# Altium project Raspberry_Hub.PrjPcb
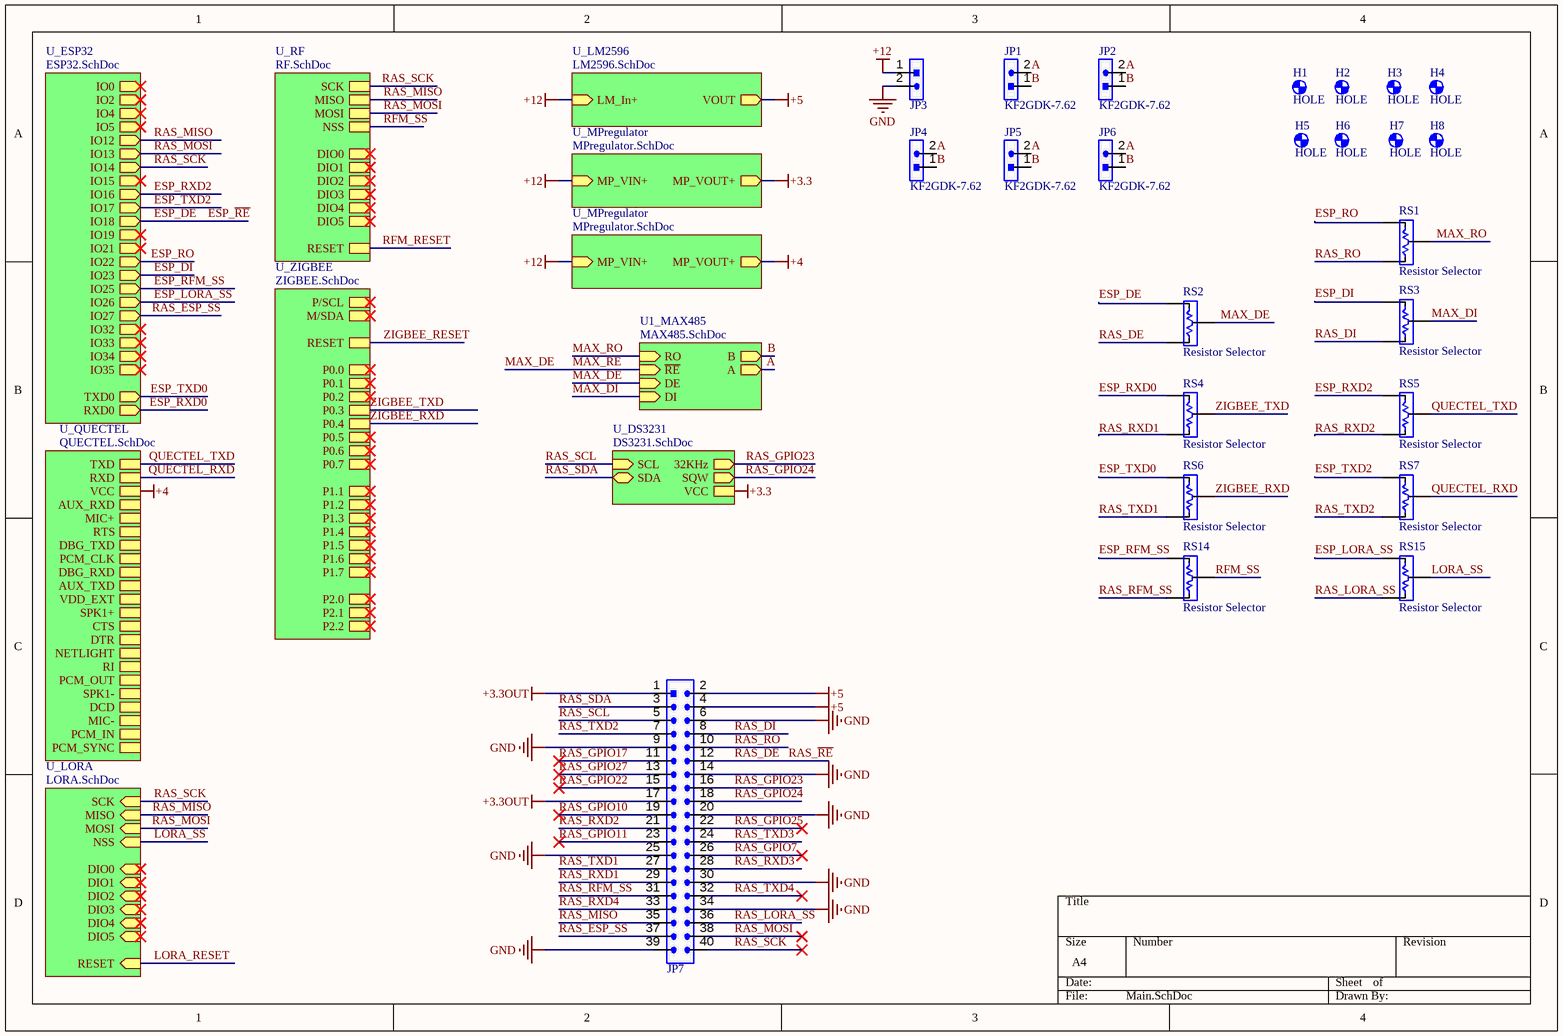
[diagram p0: Main.SchDoc]
10 sheets, 178 parts. Net scope: hierarchical (ports join the sheet entries above them; power ports are global).
Board file: RaspberryHub.PcbDoc
Sheets:
  Main.SchDoc
    U_ESP32 = ESP32.SchDoc
    U_LM2596 = LM2596.SchDoc
    U_LORA = LORA.SchDoc
    U_MPregulator = MPregulator.SchDoc
    U_QUECTEL = QUECTEL.SchDoc
    U1_MAX485 = MAX485.SchDoc
    U_RF = RF.SchDoc
    U_ZIGBEE = ZIGBEE.SchDoc
    U_DS3231 = DS3231.SchDoc
    U_MPregulator = MPregulator.SchDoc

## Sheet Main.SchDoc
size A4; SheetNumber: 1; SheetTotal: 10

### Parts
(Parts that share a designator on the sheet are numbered #1, #2 ... from top to bottom, then left to right.)
H1  HOLE  [P2.8]  (no BOM)
H2  HOLE  [P2.8]  (no BOM)
H3  HOLE  [P2.8]  (no BOM)
H4  HOLE  [P2.8]  (no BOM)
H5  HOLE  [P2.8]  (no BOM)
H6  HOLE  [P2.8]  (no BOM)
H7  HOLE  [P2.8]  (no BOM)
H8  HOLE  [P2.8]  (no BOM)
JP1#1  KF2GDK-7.62  [KF2EDGK-2P_H_7.62]
JP2#1  KF2GDK-7.62  [KF2EDGK-2P_H_7.62]
JP3#1  HDR-1X2  [KF2EDGK-2P_H_7.62]  (value not drawn)
JP4  KF2GDK-7.62  [KF2EDGK-2P_H_7.62]
JP5  KF2GDK-7.62  [KF2EDGK-2P_H_7.62]
JP6  KF2GDK-7.62  [KF2EDGK-2P_H_7.62]
JP7  Header 2X11  [HDR-20X2]  (value not drawn)
RS1  Resistor Selector  [RS 0805]
RS2  Resistor Selector  [RS 0805]
RS3  Resistor Selector  [RS 0805]
RS4  Resistor Selector  [RS 0805]
RS5  Resistor Selector  [RS 0805]
RS6  Resistor Selector  [RS 0805]
RS7  Resistor Selector  [RS 0805]
RS14  Resistor Selector  [RS 0805]
RS15  Resistor Selector  [RS 0805]

### Sub-sheets
U1_MAX485 = MAX485.SchDoc: RO (in), ~{RE} (in), DE (in), DI (in), B (out), A (out)
U_DS3231 = DS3231.SchDoc: 32KHz (out), SQW (out), SCL (in), SDA (bidir), VCC
U_ESP32 = ESP32.SchDoc: IO2 (out), IO4 (out), IO5 (out), IO12 (out), IO13 (out), IO14 (out), IO15 (out), IO16 (out), IO17 (out), IO18 (out), IO19 (out), IO21 (out), IO22 (out), IO23 (out), IO25 (out), IO26 (out), IO27 (out), IO32 (out), IO33 (out), IO34 (out), IO35 (out), TXD0 (out), RXD0 (out), IO0 (out)
U_LM2596 = LM2596.SchDoc: LM_In+ (in), VOUT (out)
U_LORA = LORA.SchDoc: DIO4 (in), DIO3 (in), DIO5 (in), RESET (in), NSS (in), SCK (in), MISO (in), DIO0 (in), DIO1 (in), DIO2 (in), MOSI (in)
U_MPregulator = MPregulator.SchDoc: MP_VOUT+ (out), MP_VIN+ (in)
U_MPregulator = MPregulator.SchDoc: MP_VOUT+ (out), MP_VIN+ (in)
U_QUECTEL = QUECTEL.SchDoc: RXD, TXD, RI, AUX_RXD, MIC+, RTS, DBG_TXD, PCM_CLK, DBG_RXD, AUX_TXD, VDD_EXT, SPK1+, CTS, DTR, NETLIGHT, VCC, PCM_OUT, SPK1-, DCD, MIC-, PCM_IN, PCM_SYNC
U_RF = RF.SchDoc: SCK, NSS, MOSI, MISO, DIO0, DIO1, DIO2, DIO3, DIO4, DIO5, RESET
U_ZIGBEE = ZIGBEE.SchDoc: P2.2, P2.1, P2.0, P1.7, P1.6, P/SCL, M/SDA, P1.5, P1.4, P1.3, RESET, P0.0, P0.1, P0.2, P0.3, P0.4, P0.5, P0.6, P0.7, P1.1, P1.2

### Nets
+3.3: sheet U_MPregulator/MP_VOUT+, sheet U_QUECTEL/VCC, sheet U_DS3231/VCC, sheet U_MPregulator/MP_VOUT+  [also labelled +4]  [project net MP_VOUT+]
+3.3OUT: JP7.1 JP7.17
+5: JP7.2 JP7.4 ; sheet U_LM2596/VOUT
+12: JP3#1.1 ; sheet U_LM2596/LM_In+, sheet U_MPregulator/MP_VIN+, sheet U_MPregulator/MP_VIN+
GND: JP3#1.2 JP7.6 JP7.9 JP7.14 JP7.20 JP7.25 JP7.30 JP7.34 JP7.39
A: JP1#1.2 JP2#1.2 JP4.2 JP5.2 JP6.2 ; sheet U1_MAX485/A  [project net 485_A]
B: JP1#1.1 JP2#1.1 JP4.1 JP5.1 JP6.1 ; sheet U1_MAX485/B  [project net 485_B]
ESP_DE: RS2.2 ; sheet U_ESP32/IO18  [also labelled ESP_~{RE}]
ESP_DI: RS3.2 ; sheet U_ESP32/IO23
ESP_LORA_SS: RS15.2 ; sheet U_ESP32/IO26
ESP_RFM_SS: RS14.2 ; sheet U_ESP32/IO25
ESP_RO: RS1.2 ; sheet U_ESP32/IO22
ESP_RXD0: RS4.2 ; sheet U_ESP32/RXD0
ESP_RXD2: RS5.2 ; sheet U_ESP32/IO16
ESP_TXD0: RS6.2 ; sheet U_ESP32/TXD0
ESP_TXD2: RS7.2 ; sheet U_ESP32/IO17
LORA_SS: RS15.3 ; sheet U_LORA/NSS
MAX_DE: RS2.3 ; sheet U1_MAX485/~{RE}, sheet U1_MAX485/DE  [also labelled MAX_~{RE}]  [project net 485_DE]
MAX_DI: RS3.3 ; sheet U1_MAX485/DI  [project net 485_DI]
MAX_RO: RS1.3 ; sheet U1_MAX485/RO  [project net 485_RO]
QUECTEL_RXD: RS7.3 ; sheet U_QUECTEL/RXD
QUECTEL_TXD: RS5.3 ; sheet U_QUECTEL/TXD
RAS_DE: JP7.12 RS2.1  [also labelled RAS_~{RE}]
RAS_DI: JP7.8 RS3.1
RAS_ESP_SS: JP7.37 ; sheet U_ESP32/IO27
RAS_GPIO7: JP7.26
RAS_GPIO10: JP7.19
RAS_GPIO11: JP7.23
RAS_GPIO17: JP7.11
RAS_GPIO22: JP7.15
RAS_GPIO23: JP7.16 ; sheet U_DS3231/32KHz  [project net 32kHz]
RAS_GPIO24: JP7.18 ; sheet U_DS3231/SQW
RAS_GPIO25: JP7.22
RAS_GPIO27: JP7.13
RAS_LORA_SS: JP7.36 RS15.1
RAS_MISO: JP7.35 ; sheet U_ESP32/IO12, sheet U_LORA/MISO, sheet U_RF/MISO
RAS_MOSI: JP7.38 ; sheet U_ESP32/IO13, sheet U_LORA/MOSI, sheet U_RF/MOSI
RAS_RFM_SS: JP7.31 RS14.1
RAS_RO: JP7.10 RS1.1
RAS_RXD1: JP7.29 RS4.1
RAS_RXD2: JP7.21 RS5.1
RAS_RXD3: JP7.28
RAS_RXD4: JP7.33
RAS_SCK: JP7.40 ; sheet U_ESP32/IO14, sheet U_LORA/SCK, sheet U_RF/SCK
RAS_SCL: JP7.5 ; sheet U_DS3231/SCL
RAS_SDA: JP7.3 ; sheet U_DS3231/SDA
RAS_TXD1: JP7.27 RS6.1
RAS_TXD2: JP7.7 RS7.1
RAS_TXD3: JP7.24
RAS_TXD4: JP7.32
RFM_SS: RS14.3 ; sheet U_RF/NSS
ZIGBEE_RXD: RS6.3 ; sheet U_ZIGBEE/P0.4
ZIGBEE_TXD: RS4.3 ; sheet U_ZIGBEE/P0.3

### Library data of the parts
H1-H8 = MOUNT-HOLE: MOUNTING HOLE with drill center marker; Rule: UNIONINDEX=0|RULEKIND=Clearance|NETSCOPE=DifferentNets|LAYERKIND=SameLayer|NAME=Schematic Clearance Constraint|GAP=0mil|GENERICCLEARANCE=0mil|IGNOREPADTOPADCLEARANCEINFOOTPRINT=FALSE|OBJECTCLEARANCES= |UNIT=Metric
JP1#1 JP2#1 JP3#1 JP4-JP6 = Header 2: 2P Connector; BOM名称: 2P接插件; 版权归属: 源创客; 学习资源: www.ooocke.com
JP7 = Header 20X2: 20*2P Connector; BOM名称: 20*2P接插件; 版权归属: 源创客; 学习资源: www.ooocke.com

## Sheet ESP32.SchDoc
size A4; SheetNumber: 4; SheetTotal: 10
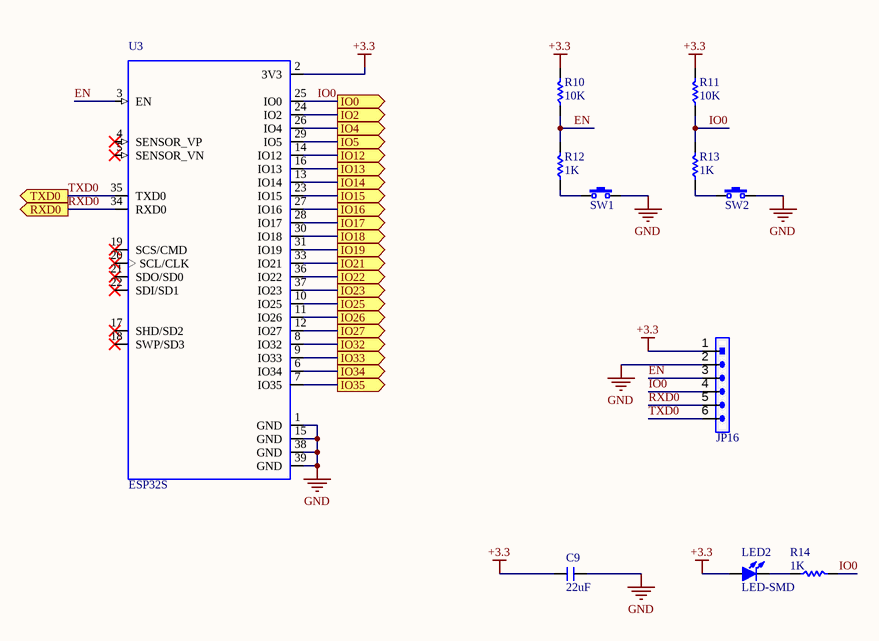
[diagram p1: ESP32.SchDoc]

### Parts
C9  22uF  [C 0805]
JP16  HDR-1X6  [HDR-1X6]  (value not drawn)
LED2  LED-SMD  [LED 0805B]
R10  10K  [R 0805]
R11  10K  [R 0805]
R12  1K  [R 0805]
R13  1K  [R 0805]
R14  1K  [R 0805]
SW1  3x6x5  [TSW SMD-3*6*2.5]  (value not drawn)
SW2  3x6x5  [TSW SMD-3*6*2.5]  (value not drawn)
U3  ESP32S  [ESP32S]

### Ports
IO0 (out), IO2 (out), IO4 (out), IO5 (out), IO12 (out), IO13 (out), IO14 (out), IO15 (out), IO16 (out), IO17 (out), IO18 (out), IO19 (out), IO21 (out), IO22 (out), IO23 (out), IO25 (out), IO26 (out), IO27 (out), IO32 (out), IO33 (out), IO34 (out), IO35 (out), RXD0 (out), TXD0 (out)

### Nets
+3.3: C9.1 JP16.1 LED2.1(A) R10.2 R11.2 U3.2(3V3)  [project net MP_VOUT+]
GND: C9.2 JP16.2 SW1.2 SW2.2 U3.1(GND) U3.15(GND) U3.38(GND) U3.39(GND)
EN: JP16.3 R10.1 R12.2 U3.3(EN)
ESP_DE: U3.30(IO18) ; port IO18
ESP_DI: U3.37(IO23) ; port IO23
ESP_LORA_SS: U3.11(IO26) ; port IO26
ESP_RFM_SS: U3.10(IO25) ; port IO25
ESP_RO: U3.36(IO22) ; port IO22
ESP_RXD2: U3.27(IO16) ; port IO16
ESP_TXD2: U3.28(IO17) ; port IO17
IO0: JP16.4 R11.1 R13.2 R14.2 U3.25(IO0) ; port IO0
RAS_ESP_SS: U3.12(IO27) ; port IO27
RAS_MISO: U3.14(IO12) ; port IO12
RAS_MOSI: U3.16(IO13) ; port IO13
RAS_SCK: U3.13(IO14) ; port IO14
RXD0: JP16.5 U3.34(RXD0) ; port RXD0  [project net ESP_RXD0]
TXD0: JP16.6 U3.35(TXD0) ; port TXD0  [project net ESP_TXD0]
NetLED2_2: LED2.2(K) R14.1
NetR12_1: R12.1 SW1.1
NetR13_1: R13.1 SW2.1
NetU3_6: U3.6(IO34) ; port IO34
NetU3_7: U3.7(IO35) ; port IO35
NetU3_8: U3.8(IO32) ; port IO32
NetU3_9: U3.9(IO33) ; port IO33
NetU3_23: U3.23(IO15) ; port IO15
NetU3_24: U3.24(IO2) ; port IO2
NetU3_26: U3.26(IO4) ; port IO4
NetU3_29: U3.29(IO5) ; port IO5
NetU3_31: U3.31(IO19) ; port IO19
NetU3_33: U3.33(IO21) ; port IO21

Not connected (* = marked no-connect by the designer): U3 4(SENSOR_VP)* 5(SENSOR_VN)* 17(SHD/SD2)* 18(SWP/SD3)* 19(SCS/CMD)* 20(SCL/CLK)* 21(SDO/SD0)* 22(SDI/SD1)*

### Library data of the parts
C9 = C: Non-polar patch capacitor; BOM名称: 无极性贴片电容; 版权归属: 源创客; 学习资源: www.ooocke.com
JP16 = Header 6: 6P Connector; BOM名称: 6P接插件; 版权归属: 源创客; 学习资源: www.ooocke.com
LED2 = LED-SMD: Patch LED; BOM名称: 贴片LED; 版权归属: 源创客; 学习资源: www.ooocke.com
R10-R14 = R: Chip resistor; 版权归属: 源创客; BOM名称: Chip resistor; 学习资源: www.ooocke.com
SW1 SW2 = TSW 3x6: 3x6 tact switch; BOM名称: 3x6轻触开关; 版权归属: 源创客; 学习资源: www.ooocke.com
U3 = ESP32S: MP: ESP32-WROOM-32D; MF: Espressif Systems; Package: Module Espressif Systems; Price: None; Availability: Unavailable; SnapEDA_Link: https://www.snapeda.com/parts/ESP32-WROOM-32D/Espressif%20Systems/view-part/?ref=snap; Value: *

## Sheet LM2596.SchDoc
size A4; SheetNumber: 2; SheetTotal: 10
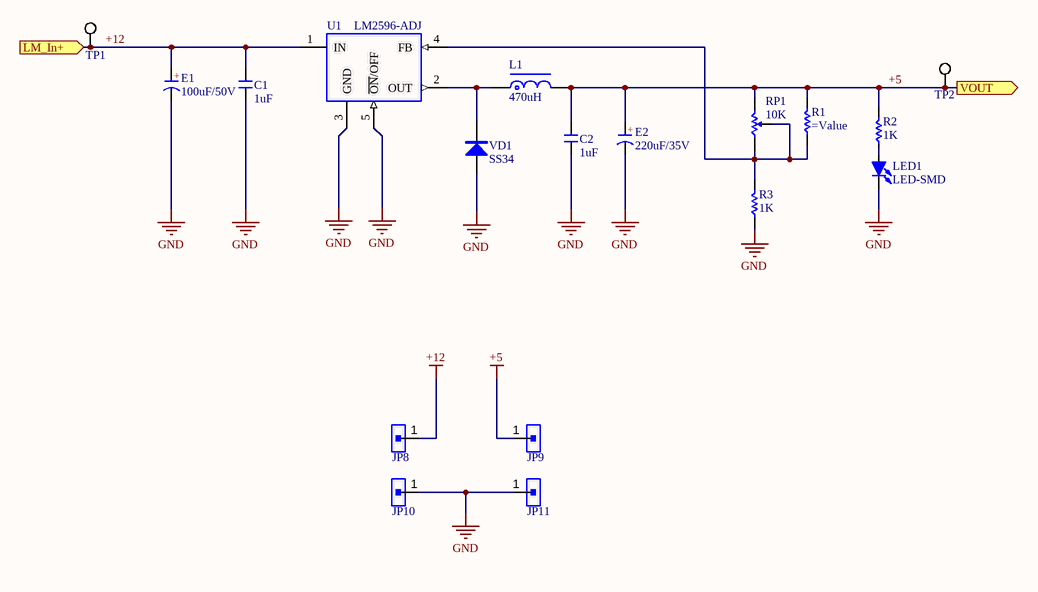
[diagram p2: LM2596.SchDoc]

### Parts
C1  1uF  [C 0805]
C2  1uF  [C 0805]
E1  100uF/50V  [CM E(8*10.2)]
E2  220uF/35V  [CM E(8*10.2)]
JP8  HDR-1X1  [HDR-1X1]  (value not drawn)
JP9  HDR-1X1  [HDR-1X1]  (value not drawn)
JP10  HDR-1X1  [HDR-1X1]  (value not drawn)
JP11  HDR-1X1  [HDR-1X1]  (value not drawn)
L1  470uH  [CDRH127]
LED1  LED-SMD  [LED 0805R]
R1  (no value)  [R 0805]
R2  1K  [R 0805]
R3  1K  [R 0805]
RP1  10K  [3296W]
TP1  Test Point Pad  [TP15]  (value not drawn)
TP2  Test Point Pad  [TP15]  (value not drawn)
U1  LM2596-ADJ  [TO263-5A]
VD1  SS34  [SMA]

### Ports
LM_In+ (in), VOUT (out)

### Nets
+5: C2.2 E2.1(A) JP9.1 L1.2 R1.2 R2.2 RP1.2 TP2.1 ; port VOUT
+12: C1.2 E1.1(A) JP8.1 TP1.1 U1.1(IN) ; port LM_In+
GND: C1.1 C2.1 E1.2(K) E2.2(K) JP10.1 JP11.1 LED1.2(K) R3.1 U1.3(GND) U1.5(~{ON}/OFF) VD1.1(A)
NetL1_1: L1.1 U1.2(OUT) VD1.2(K)
NetLED1_1: LED1.1(A) R2.1
NetR1_1: R1.1 R3.2 RP1.1 RP1.ADJ U1.4(FB)

### Notes on the sheet
- (in symbol C-CM) +

### Library data of the parts
C1 C2 = C: as C9 on sheet ESP32; 学习资源: www.ooocke.com
E1 E2 = C-CM: Chip electrolytic capacitor; BOM名称: 贴片电解电容; 版权归属: 源创客; 学习资源: www.ooocke.com
JP8-JP11 = Header 1: 1P Connector; BOM名称: 1P接插件; 版权归属: 源创客; 学习资源: www.ooocke.com
L1 = L-CDRH: Power shielded inductor; BOM名称: 功率屏蔽电感; 版权归属: 源创客; 学习资源: www.ooocke.com
LED1 = LED-SMD: Patch LED; BOM名称: 贴片LED; 版权归属: 源创客; 学习资源: www.ooocke.com
R1-R3 = R: Chip resistor; 版权归属: 源创客; BOM名称: Chip resistor; 学习资源: www.ooocke.com
RP1 = RP-THD: Plug-in potentiometer; BOM名称: 插件电位器; 版权归属: 源创客; 学习资源: www.ooocke.com
TP1 TP2 = Test Point Pad: Company: SJ Libraries; Designer: Eng. Saeid Jorablo; Rule: UNIONINDEX=0|RULEKIND=ComponentClearance|NETSCOPE=AnyNet|LAYERKIND=SameLayer|NAME=Schematic Component Clearance Constraint|GAP=0mil|COLLISIONCHECKMODE=3|VERTICALGAP=0mil|SHOWDISTANCES=FALSE|UNIT=Imperial; Mounting Technology: Surface Mount\Through-Hole; ComponentLink1Description: Datasheet; Pin Count: 0; Update Date: 6/3/2012; Category: MISC; HelpURL: http://s3.picofile.com/file/7443264187/Coming_Soon_logo.gif
U1 = LM2596: DC step-down chip; BOM名称: DC稳压芯片; 版权归属: 源创客; 学习资源: www.ooocke.com
VD1 = SS34: Schottky diodes; BOM名称: 肖特基二极管; 版权归属: 源创客; 属性: 40V/3A; 学习资源: www.ooocke.com

## Sheet LORA.SchDoc
size A4; SheetNumber: 5; SheetTotal: 10
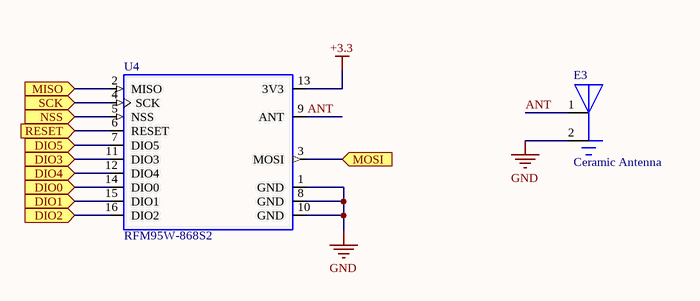
[diagram p3: LORA.SchDoc]

### Parts
E3  Ceramic Antenna  [Ceramic_915M]
U4  RFM95W-868S2  [XCVR_RFM95W-868S2]

### Ports
DIO0 (in), DIO1 (in), DIO2 (in), DIO3 (in), DIO4 (in), DIO5 (in), MISO (in), MOSI (in), NSS (in), RESET (in), SCK (in)

### Nets
+3.3: U4.13(3V3)  [project net MP_VOUT+]
GND: E3.2 U4.1(GND) U4.8(GND) U4.10(GND)
ANT: E3.1 U4.9(ANT)
LORA_RESET: U4.6(RESET) ; port RESET
LORA_SS: U4.5(NSS) ; port NSS
RAS_MISO: U4.2(MISO) ; port MISO
RAS_MOSI: U4.3(MOSI) ; port MOSI
RAS_SCK: U4.4(SCK) ; port SCK
NetU4_7: U4.7(DIO5) ; port DIO5
NetU4_11: U4.11(DIO3) ; port DIO3
NetU4_12: U4.12(DIO4) ; port DIO4
NetU4_14: U4.14(DIO0) ; port DIO0
NetU4_15: U4.15(DIO1) ; port DIO1
NetU4_16: U4.16(DIO2) ; port DIO2

### Library data of the parts
U4 = RFM95W-868S2: General ISM < 1GHz LoRa Transceiver Module 868MHz Antenna Not Included Surface Mount; MF: RF; Availability: Unavailable; Price: None; Package: SMD-16 Hope Microelectronics; MP: RFM95W-868S2; Value: *; SnapEDA_Link: https://www.snapeda.com/parts/RFM95W-868S2/RF%20Solutions/view-part/329180/?ref=snap

## Sheet MPregulator.SchDoc
size A4; SheetNumber: 3; SheetTotal: 10
Used 2 times, as channels U_MPregulator, U_MPregulator. Parts and nets are listed once, with the designators drawn on the sheet.
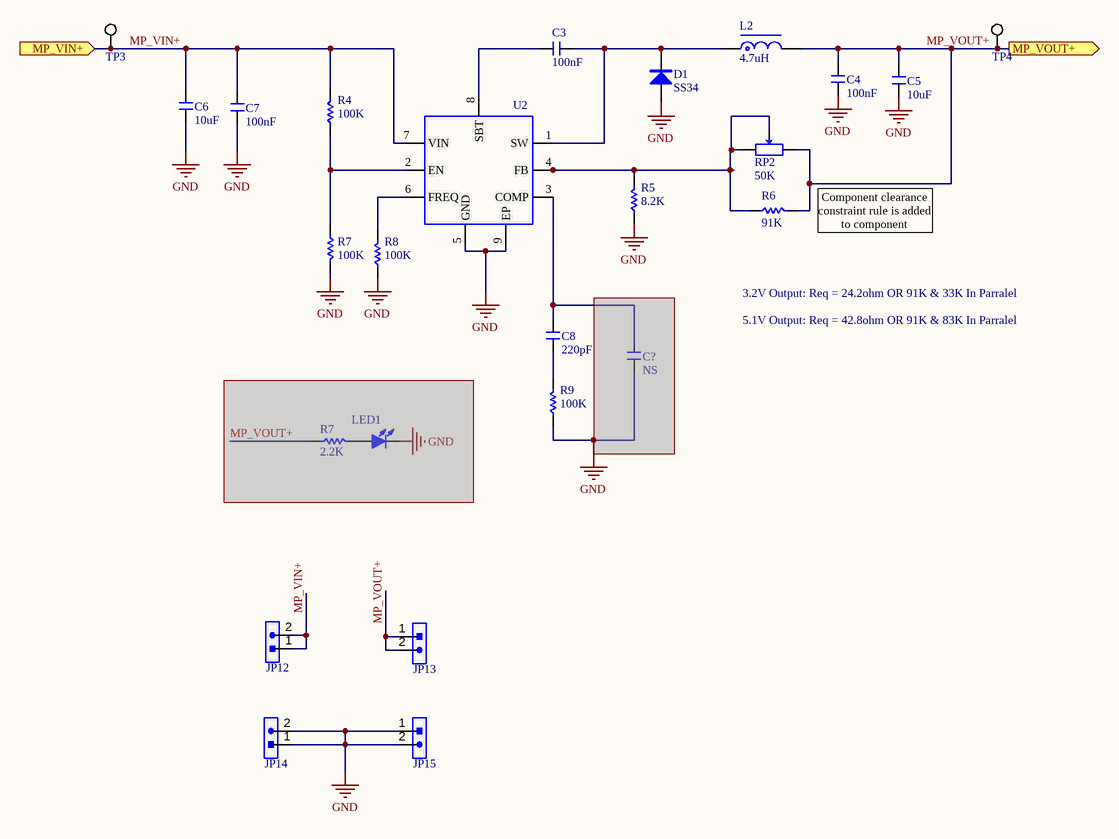
[diagram p4: MPregulator.SchDoc]

### Parts
(Parts that share a designator on the sheet are numbered #1, #2 ... from top to bottom, then left to right.)
C3  100nF  [C 0805]
C4  100nF  [C 0805]
C5  10uF  [C 1206]
C6  10uF  [C 1206]
C7  100nF  [C 0805]
C8  220pF  [C 0805]
C?  NS  [C 0805]  (masked out: inside a compile mask, not in the netlist)
D1  SS34  [SMA]
JP12  HDR-1X2  [HDR-1X2]  (value not drawn)
JP13  HDR-1X2  [HDR-1X2]  (value not drawn)
JP14  HDR-1X2  [HDR-1X2]  (value not drawn)
JP15  HDR-1X2  [HDR-1X2]  (value not drawn)
L2  4.7uH  [WHC0630]
LED1  Power  [LED 0805R]  (value not drawn)  (masked out: inside a compile mask, not in the netlist)
R4  100K  [R 0805]
R5  8.2K  [R 0805]
R6  91K  [R 0805]
R7#1  100K  [R 0805]
R7#2  2.2K  [R 0805]  (masked out: inside a compile mask, not in the netlist)
R8  100K  [R 0805]
R9  100K  [R 0805]
RP2  50K  [3303W]
TP3  Test Point Pad  [TP15]  (value not drawn)
TP4  Test Point Pad  [TP15]  (value not drawn)
U2  (no value)  [SOP8_N-EP]

### Ports
MP_VIN+ (in), MP_VOUT+ (out)

### Nets
GND: C4.1 C5.1 C6.2 C7.1 D1.1(A) JP14.1 JP14.2 JP15.1 JP15.2 R5.1 R7#1.2 R8.1 U2.5(GND) U2.9(EP)
MP_VIN+: C6.1 C7.2 JP12.1 JP12.2 R4.2 TP3.1 U2.7(VIN) ; port MP_VIN+
MP_VOUT+: C4.2 C5.2 JP13.1 JP13.2 L2.2 R6.2 RP2.2 TP4.1 ; port MP_VOUT+
NetC3_1: C3.1 U2.8(SBT)
NetC3_2: C3.2 D1.2(K) L2.1 U2.1(SW)
NetC8_1: C8.1 U2.3(COMP)
NetC8_2: C8.2 R9.2
NetR4_1: R4.1 R7#1.1 U2.2(EN)
NetR5_2: R5.2 R6.1 RP2.1 RP2.ADJ U2.4(FB)
NetR8_2: R8.2 U2.6(FREQ)

Not connected (* = marked no-connect by the designer): R9 1

### Channels
U_MPregulator: designators C3=C3_U_MPregulator#1 C4=C4_U_MPregulator#1 C5=C5_U_MPregulator#1 C6=C6_U_MPregulator#1 C7=C7_U_MPregulator#1 C8=C8_U_MPregulator#1 C?=C?_U_MPregulator#1 D1=D1_U_MPregulator#1 JP12=JP12_U_MPregulator#1 JP13=JP13_U_MPregulator#1 JP14=JP14_U_MPregulator#1 JP15=JP15_U_MPregulator#1 L2=L2_U_MPregulator#1 LED1=LED1_U_MPregulator#1 R4=R4_U_MPregulator#1 R5=R5_U_MPregulator#1 R6=R6_U_MPregulator#1 R7=R7_U_MPregulator#1 R7=R7_U_MPregulator#2 R8=R8_U_MPregulator#1 R9=R9_U_MPregulator#1 RP2=RP2_U_MPregulator#1 TP3=TP3_U_MPregulator#1 TP4=TP4_U_MPregulator#1 U2=U2_U_MPregulator#1; ports MP_VIN+=+12 MP_VOUT+=MP_VOUT+
U_MPregulator: designators C3=C3_U_MPregulator#2 C4=C4_U_MPregulator#2 C5=C5_U_MPregulator#2 C6=C6_U_MPregulator#2 C7=C7_U_MPregulator#2 C8=C8_U_MPregulator#2 C?=C?_U_MPregulator#2 D1=D1_U_MPregulator#2 JP12=JP12_U_MPregulator#2 JP13=JP13_U_MPregulator#2 JP14=JP14_U_MPregulator#2 JP15=JP15_U_MPregulator#2 L2=L2_U_MPregulator#2 LED1=LED1_U_MPregulator#2 R4=R4_U_MPregulator#2 R5=R5_U_MPregulator#2 R6=R6_U_MPregulator#2 R7=R7_U_MPregulator#3 R7=R7_U_MPregulator#4 R8=R8_U_MPregulator#2 R9=R9_U_MPregulator#2 RP2=RP2_U_MPregulator#2 TP3=TP3_U_MPregulator#2 TP4=TP4_U_MPregulator#2 U2=U2_U_MPregulator#2; ports MP_VIN+=+12 MP_VOUT+=MP_VOUT+

### Notes on the sheet
- Component clearance constraint rule is added to component parameters
- 5.1V Output: Req = 42.8ohm OR 91K & 83K In Parralel
- 3.2V Output: Req = 24.2ohm OR 91K & 33K In Parralel

### Library data of the parts
C3-C8 C? = C: as C9 on sheet ESP32; 学习资源: www.ooocke.com
D1 = SS34: as VD1 on sheet LM2596; 学习资源: www.ooocke.com
JP12-JP15 = Header 2: 2P Connector; BOM名称: 2P接插件; 版权归属: 源创客; 学习资源: www.ooocke.com
L2 = L-WHC: One-piece high current inductor
LED1 = LED-SMD: RED LED; BOM名称: 贴片LED; 版权归属: 源创客; 学习资源: www.ooocke.com
R4 R5 R7#1 R7#2 R8 R9 = R: Chip resistor; 版权归属: 源创客; BOM名称: Chip resistor; 学习资源: www.ooocke.com
R6 = R: Chip resistor; 版权归属: 源创客; Rule: UNIONINDEX=0|RULEKIND=ComponentClearance|NETSCOPE=AnyNet|LAYERKIND=SameLayer|NAME=Schematic Component Clearance Constraint|GAP=0mil|COLLISIONCHECKMODE=3|VERTICALGAP=0mil|SHOWDISTANCES=FALSE|UNIT=Imperial; BOM名称: Chip resistor; 学习资源: www.ooocke.com
RP2 = RP-SMD: Chip potentiometer; BOM名称: 贴片电位器; 版权归属: 源创客; Rule: UNIONINDEX=0|RULEKIND=ComponentClearance|NETSCOPE=AnyNet|LAYERKIND=SameLayer|NAME=Schematic Component Clearance Constraint|GAP=0mil|COLLISIONCHECKMODE=3|VERTICALGAP=0mil|SHOWDISTANCES=FALSE|UNIT=Imperial; 学习资源: www.ooocke.com
TP3 TP4 = Test Point Pad: as TP1 on sheet LM2596; Mounting Technology: Surface Mount\Through-Hole; ComponentLink1Description: Datasheet; Pin Count: 0; Update Date: 6/3/2012; Category: MISC; HelpURL: http://s3.picofile.com/file/7443264187/Coming_Soon_logo.gif
U2 = MP1584: DC step-down chip

## Sheet QUECTEL.SchDoc
size A4; SheetNumber: 9; SheetTotal: 10
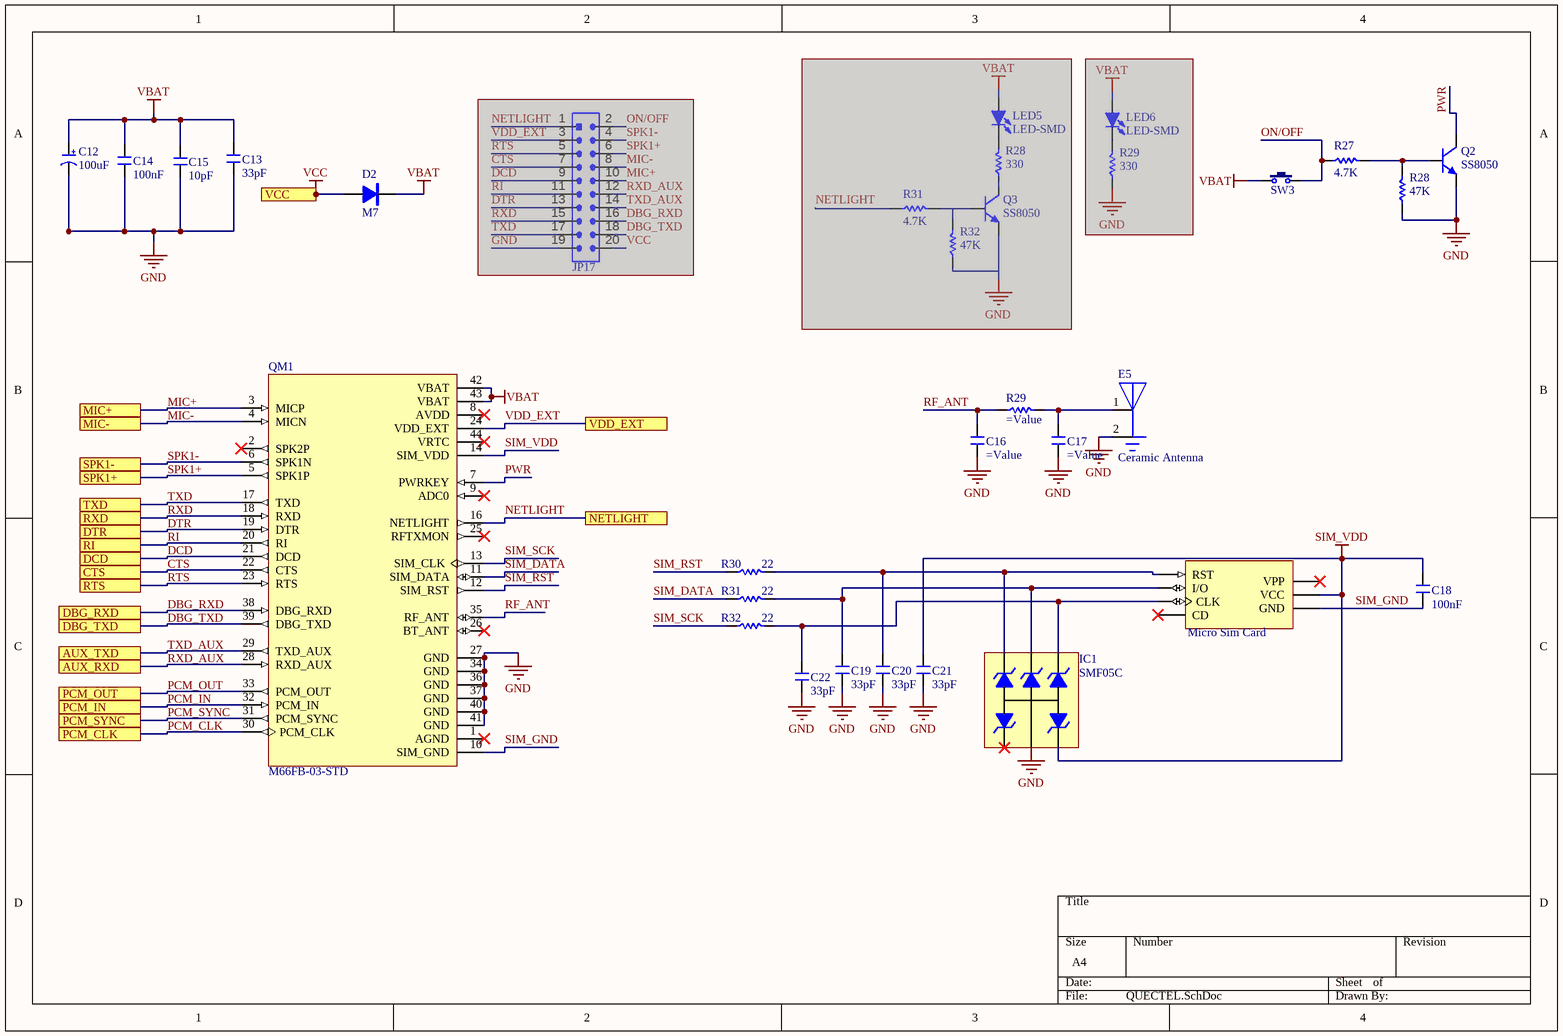
[diagram p5: QUECTEL.SchDoc]

### Parts
(Parts that share a designator on the sheet are numbered #1, #2 ... from top to bottom, then left to right.)
C12  100uF  [CD A(3216)]
C13  33pF  [C 0805]
C14  100nF  [C 0805]
C15  10pF  [C 0805]
C16  (no value)  [C 0805]
C17  (no value)  [C 0805]
C18  100nF  [C 0805]
C19  33pF  [C 0805]
C20  33pF  [C 0805]
C21  33pF  [C 0805]
C22  33pF  [C 0805]
D2  M7  [SMA]
E5  Ceramic Antenna  [Ceramic_915M]
IC1  SMF05C  [SOT23-6L]
JP17#1  Header 2X10  [HDR-10X2]  (value not drawn)  (masked out: inside a compile mask, not in the netlist)
LED5  LED-SMD  [LED 0805W]  (masked out: inside a compile mask, not in the netlist)
LED6  LED-SMD  [LED 0805W]  (masked out: inside a compile mask, not in the netlist)
Q2  SS8050  [SOT23-3N]
Q3  SS8050  [SOT23-3N]  (masked out: inside a compile mask, not in the netlist)
QM1  M66FB-03-STD  [Quectel M66FB]
R27  4.7K  [R 0805]
R28#1  330  [R 0805]  (masked out: inside a compile mask, not in the netlist)
R28#2  47K  [R 0805]
R29#1  330  [R 0805]  (masked out: inside a compile mask, not in the netlist)
R29#2  (no value)  [R 0805]
R30  22  [R 0805]
R31#1  4.7K  [R 0805]  (masked out: inside a compile mask, not in the netlist)
R31#2  22  [R 0805]
R32#1  47K  [R 0805]  (masked out: inside a compile mask, not in the netlist)
R32#2  22  [R 0805]
Sim_Holder1  Micro Sim Card  [Micro Sim Card]
SW3  3x6x5  [TSW DIP-3*6*5]  (value not drawn)

### Ports
AUX_RXD, AUX_TXD, CTS, DBG_RXD, DBG_TXD, DCD, DTR, MIC+, MIC-, NETLIGHT, PCM_CLK, PCM_IN, PCM_OUT, PCM_SYNC, RI, RTS, RXD, SPK1+, SPK1-, TXD, VCC, VDD_EXT

### Nets
GND: C12.2(K) C13.1 C14.1 C15.1 C16.1 C17.1 C19.1 C20.1 C21.1 C22.1 E5.2 IC1.2(A) Q2.2(E) QM1.27(GND) QM1.34(GND) QM1.36(GND) QM1.37(GND) QM1.40(GND) QM1.41(GND) R28#2.1
SIM_VDD: C18.2 C21.2 IC1.3(K) QM1.14(SIM_VDD) Sim_Holder1.C1(VCC)
VBAT: C12.1(A) C13.2 C14.2 C15.2 D2.2(K) QM1.42(VBAT) QM1.43(VBAT) SW3.1
VCC: D2.1(A) ; port VCC  [project net MP_VOUT+]
CTS: QM1.22(CTS) ; port CTS
DBG_RXD: QM1.38(DBG_RXD) ; port DBG_RXD
DBG_TXD: QM1.39(DBG_TXD) ; port DBG_TXD
DCD: QM1.21(DCD) ; port DCD
DTR: QM1.19(DTR) ; port DTR
MIC+: QM1.3(MICP) ; port MIC+
MIC-: QM1.4(MICN) ; port MIC-
NETLIGHT: QM1.16(NETLIGHT) ; port NETLIGHT
ON/OFF: R27.1 SW3.2
PCM_CLK: QM1.30(PCM_CLK) ; port PCM_CLK
PCM_IN: QM1.32(PCM_IN) ; port PCM_IN
PCM_OUT: QM1.33(PCM_OUT) ; port PCM_OUT
PCM_SYNC: QM1.31(PCM_SYNC) ; port PCM_SYNC
PWR: Q2.3(C) QM1.7(PWRKEY)
RF_ANT: C16.2 QM1.35(RF_ANT) R29#2.1
RI: QM1.20(RI) ; port RI
RTS: QM1.23(RTS) ; port RTS
RXD: QM1.18(RXD) ; port RXD  [project net QUECTEL_RXD]
RXD_AUX: QM1.28(RXD_AUX) ; port AUX_RXD
SIM_DATA: QM1.11(SIM_DATA) R31#2.1
SIM_GND: C18.1 QM1.10(SIM_GND) Sim_Holder1.C5(GND)
SIM_RST: QM1.12(SIM_RST) R30.1
SIM_SCK: QM1.13(SIM_CLK) R32#2.1
SPK1+: QM1.5(SPK1P) ; port SPK1+
SPK1-: QM1.6(SPK1N) ; port SPK1-
TXD: QM1.17(TXD) ; port TXD  [project net QUECTEL_TXD]
TXD_AUX: QM1.29(TXD_AUX) ; port AUX_TXD
VDD_EXT: QM1.24(VDD_EXT) ; port VDD_EXT
NetC17_2: C17.2 E5.1 R29#2.2
NetC19_2: C19.2 IC1.5(K) R31#2.2 Sim_Holder1.C7(I/O)
NetC20_2: C20.2 IC1.4(K) R30.2 Sim_Holder1.C2(RST)
NetC22_2: C22.2 IC1.6(K) R32#2.2 Sim_Holder1.C3(CLK)
NetQ2_1: Q2.1(B) R27.2 R28#2.2

Not connected (* = marked no-connect by the designer): IC1 1(K)*; QM1 1(AGND)* 2(SPK2P)* 8(AVDD)* 9(ADC0)* 25(RFTXMON)* 26(BT_ANT)* 44(VRTC)*; Sim_Holder1 C6(VPP)* CD*

### Notes on the sheet
- (in symbol C-CD) +

### Library data of the parts
C12 = C-CD: Solid Tantalum Chip Capacitor, Standard T491 Series - Industrial Grade; Published: 17-Jul-2002; LatestRevisionDate: 19-Mar-2004; LatestRevisionNote: Silkscreen dimensions re-sized.; DatasheetDocument: Mar-2001; PackageDocument: Mar-2001; PackageReference: B; Publisher: Altium Limited; Code_JEITA: 3528-21; ComponentLink1Description: Manufacturer Link; ComponentLink1URL: http://www.kemet.com/; ComponentLink2Description: Datasheet; ComponentLink2URL: http://www.kemet.com/kemet/web/homepage/kechome.nsf/vapubfilesname/F3102TA.pdf/$file/F3102TA.pdf
C13-C22 = C: as C9 on sheet ESP32; 学习资源: www.ooocke.com
D2 = M7: Rectifier diode; BOM名称: 整流二极管; 版权归属: 源创客; 学习资源: www.ooocke.com
IC1 = SMF05C: ESD Protection Diode Array, 5-Line
JP17#1 = Header 10X2: 10*2P Connector; BOM名称: 10*2P接插件; 版权归属: 源创客; 学习资源: www.ooocke.com
LED5 LED6 = LED-SMD: Patch LED; BOM名称: 贴片LED; 版权归属: 源创客; 学习资源: www.ooocke.com
Q2 Q3 = 8050-SMD: High frequency amplification-NPN; BOM名称: 高频放大-NPN型; 版权归属: 源创客; 属性: 40V 1.5A 1W 100MHZ; 学习资源: www.ooocke.com
QM1 = Quectel M66: Package: None; MP: M66FB-03-STD; MF: Quectel; Availability: Unavailable; Price: None; SnapEDA_Link: https://www.snapeda.com/parts/M66FB-03-STD/Quectel/view-part/?ref=snap; Value: *
R27 R28#1 R28#2 R29#1 R29#2 R30 R31#1 R31#2 R32#1 R32#2 = R: Chip resistor; 版权归属: 源创客; BOM名称: Chip resistor; 学习资源: www.ooocke.com
Sim_Holder1 = Micro Sim Card: SIMCARD 6PIN
SW3 = TSW 3x6: as SW1 on sheet ESP32; 学习资源: www.ooocke.com

## Sheet MAX485.SchDoc
size A4; SheetNumber: 8; SheetTotal: 10
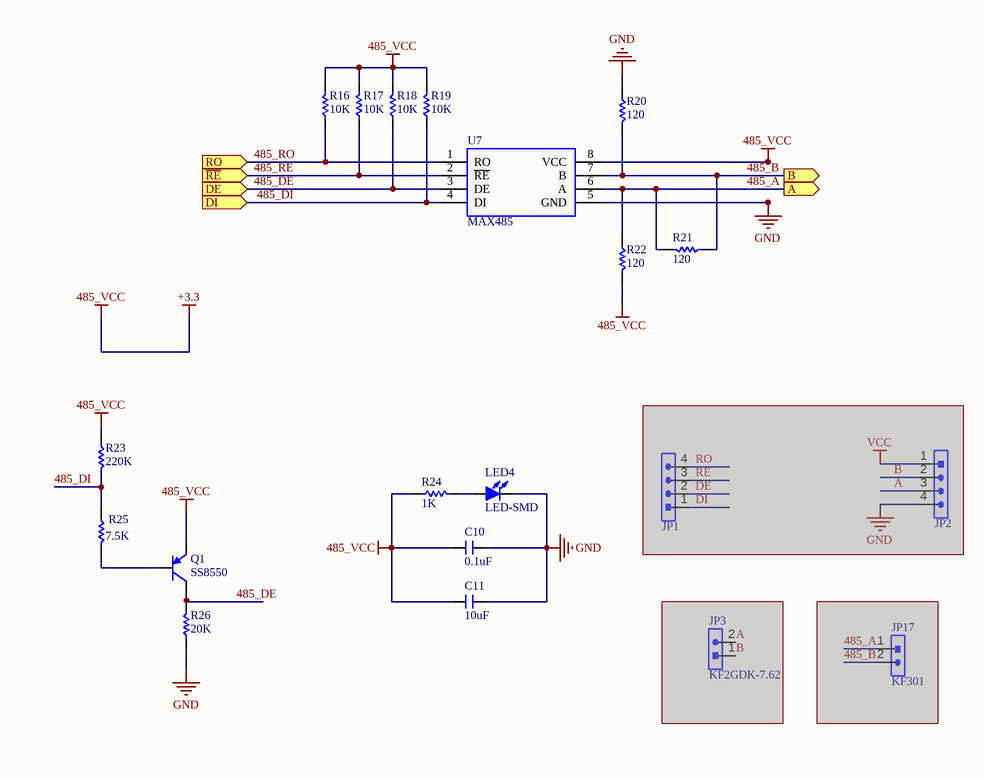
[diagram p6: MAX485.SchDoc]

### Parts
(Parts that share a designator on the sheet are numbered #1, #2 ... from top to bottom, then left to right.)
C10  0.1uF  [C 0805]
C11  10uF  [C 1206]
JP1#2  HDR-1X4  [HDR-1X4]  (value not drawn)  (masked out: inside a compile mask, not in the netlist)
JP2#2  HDR-1X4  [HDR-1X4]  (value not drawn)  (masked out: inside a compile mask, not in the netlist)
JP3#2  KF2GDK-7.62  [KF2EDGK-2P_H_7.62]  (masked out: inside a compile mask, not in the netlist)
JP17#2  KF301  [KF301-2P]  (masked out: inside a compile mask, not in the netlist)
LED4  LED-SMD  [LED 0805R]
Q1  SS8550  [SOT23-3N]
R16  10K  [R 0805]
R17  10K  [R 0805]
R18  10K  [R 0805]
R19  10K  [R 0805]
R20  120  [R 0805]
R21  120  [R 0805]
R22  120  [R 0805]
R23  220K  [R 0805]
R24  1K  [R 0805]
R25  7.5K  [R 0805]
R26  20K  [R 0805]
U7  MAX485  [SOP8_N]

### Ports
A (out), B (out), DE (in), DI (in), RO (in), ~{RE} (in)

### Nets
+3.3: C10.1 C11.1 Q1.2(E) R16.2 R17.2 R18.2 R19.2 R22.2 R23.1 R24.1 U7.8(VCC)  [also labelled 485_VCC]  [project net MP_VOUT+]
GND: C10.2 C11.2 LED4.2(K) R20.1 R26.1 U7.5(GND)
485_A: R21.2 R22.1 U7.6(A) ; port A
485_B: R20.2 R21.1 U7.7(B) ; port B
485_DE: Q1.3(C) R17.1 R18.1 R26.2 U7.2(~{RE}) U7.3(DE) ; port ~{RE}, port DE  [also labelled 485_~{RE}]
485_DI: R19.1 R23.2 R25.1 U7.4(DI) ; port DI
485_RO: R16.1 U7.1(RO) ; port RO
NetLED4_1: LED4.1(A) R24.2
NetQ1_1: Q1.1(B) R25.2

### Library data of the parts
C10 C11 = C: as C9 on sheet ESP32; 学习资源: www.ooocke.com
JP1#2 JP2#2 = Header 4: 4P Connector; BOM名称: 4P接插件; 版权归属: 源创客; 学习资源: www.ooocke.com
JP3#2 JP17#2 = Header 2: 2P Connector; BOM名称: 2P接插件; 版权归属: 源创客; 学习资源: www.ooocke.com
LED4 = LED-SMD: Patch LED; BOM名称: 贴片LED; 版权归属: 源创客; 学习资源: www.ooocke.com
Q1 = 8550-SMD: High Frequency Amplifier-PNP; BOM名称: 高频放大-PNP型; 版权归属: 源创客; 属性: 40V 1.5A 1W 100MHZ; 学习资源: www.ooocke.com
R16-R26 = R: Chip resistor; 版权归属: 源创客; BOM名称: Chip resistor; 学习资源: www.ooocke.com
U7 = MAX485: RS485/RS422 Transceivers; BOM名称: MAX232; 版权归属: 源创客; 学习资源: www.ooocke.com

## Sheet RF.SchDoc
size A4; SheetNumber: 7; SheetTotal: 10
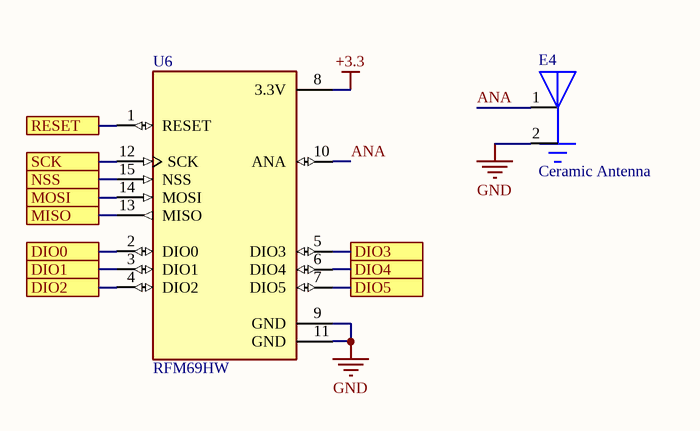
[diagram p7: RF.SchDoc]

### Parts
E4  Ceramic Antenna  [Ceramic_915M]
U6  RFM69HW  [RFM69HW]

### Ports
DIO0, DIO1, DIO2, DIO3, DIO4, DIO5, MISO, MOSI, NSS, RESET, SCK

### Nets
+3.3: U6.8(3.3V)  [project net MP_VOUT+]
GND: E4.2 U6.9(GND) U6.11(GND)
ANA: E4.1 U6.10(ANA)
RAS_MISO: U6.13(MISO) ; port MISO
RAS_MOSI: U6.14(MOSI) ; port MOSI
RAS_SCK: U6.12(SCK) ; port SCK
RFM_RESET: U6.1(RESET) ; port RESET
RFM_SS: U6.15(NSS) ; port NSS
NetU6_2: U6.2(DIO0) ; port DIO0
NetU6_3: U6.3(DIO1) ; port DIO1
NetU6_4: U6.4(DIO2) ; port DIO2
NetU6_5: U6.5(DIO3) ; port DIO3
NetU6_6: U6.6(DIO4) ; port DIO4
NetU6_7: U6.7(DIO5) ; port DIO5

## Sheet ZIGBEE.SchDoc
size A4; SheetNumber: 6; SheetTotal: 10
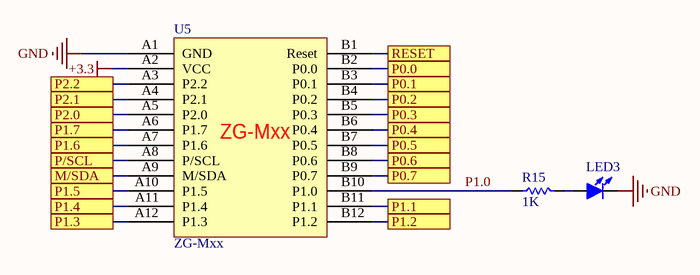
[diagram p8: ZIGBEE.SchDoc]

### Parts
LED3  LED-SMD  [LED 0805B]  (value not drawn)
R15  1K  [R 0805]
U5  ZG-Mxx  [ZG-M0/M1/M1E]

### Ports
M/SDA, P0.0, P0.1, P0.2, P0.3, P0.4, P0.5, P0.6, P0.7, P1.1, P1.2, P1.3, P1.4, P1.5, P1.6, P1.7, P2.0, P2.1, P2.2, P/SCL, RESET

### Nets
+3.3: U5.A2(VCC)  [project net MP_VOUT+]
GND: LED3.2(K) U5.A1(GND)
P1.0: R15.1 U5.B10(P1.0)
ZIGBEE_RESET: U5.B1(Reset) ; port RESET
ZIGBEE_RXD: U5.B6(P0.4) ; port P0.4
ZIGBEE_TXD: U5.B5(P0.3) ; port P0.3
NetLED3_1: LED3.1(A) R15.2
NetU5_A3: U5.A3(P2.2) ; port P2.2
NetU5_A4: U5.A4(P2.1) ; port P2.1
NetU5_A5: U5.A5(P2.0) ; port P2.0
NetU5_A6: U5.A6(P1.7) ; port P1.7
NetU5_A7: U5.A7(P1.6) ; port P1.6
NetU5_A8: U5.A8(P/SCL) ; port P/SCL
NetU5_A9: U5.A9(M/SDA) ; port M/SDA
NetU5_A10: U5.A10(P1.5) ; port P1.5
NetU5_A11: U5.A11(P1.4) ; port P1.4
NetU5_A12: U5.A12(P1.3) ; port P1.3
NetU5_B2: U5.B2(P0.0) ; port P0.0
NetU5_B3: U5.B3(P0.1) ; port P0.1
NetU5_B4: U5.B4(P0.2) ; port P0.2
NetU5_B7: U5.B7(P0.5) ; port P0.5
NetU5_B8: U5.B8(P0.6) ; port P0.6
NetU5_B9: U5.B9(P0.7) ; port P0.7
NetU5_B11: U5.B11(P1.1) ; port P1.1
NetU5_B12: U5.B12(P1.2) ; port P1.2

### Library data of the parts
LED3 = LED-SMD: Patch LED; BOM名称: 贴片LED; 版权归属: 源创客; 学习资源: www.ooocke.com
R15 = R: Chip resistor; 版权归属: 源创客; BOM名称: Chip resistor; 学习资源: www.ooocke.com
U5 = ZG-Mxx: Zigbee Ghostyu

## Sheet DS3231.SchDoc
size A4; SheetNumber: 10; SheetTotal: 10
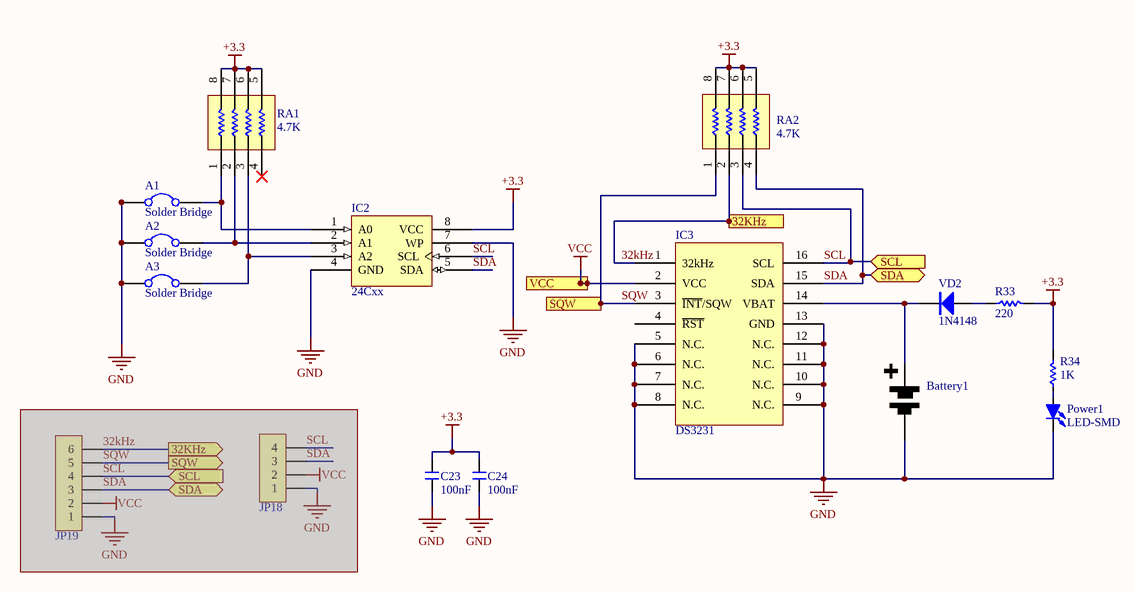
[diagram p9: DS3231.SchDoc]

### Parts
A1  Solder Bridge  [Solder Bridge]
A2  Solder Bridge  [Solder Bridge]
A3  Solder Bridge  [Solder Bridge]
Battery1  Battery Button Cell  [CR2032]  (value not drawn)
C23  100nF  [C 0805]
C24  100nF  [C 0805]
IC2  24Cxx  [SOP8_L]
IC3  DS3231  [SOP16W_L]
JP18  HDR-1X4  [HDR-1X4]  (value not drawn)  (masked out: inside a compile mask, not in the netlist)
JP19  HDR-1X6  [HDR-1X6]  (value not drawn)  (masked out: inside a compile mask, not in the netlist)
Power1  LED-SMD  [LED 0805R]
R33  220  [R 0805]
R34  1K  [R 0805]
RA1  4.7K  [RA1206 (4x0603)]
RA2  4.7K  [RA1206 (4x0603)]
VD2  1N4148  [MINI_MELF (LL34)]

### Ports
32KHz (out), SCL (in), SDA (bidir), SQW (out), VCC

### Nets
+3.3: C23.1 C24.2 IC2.8(VCC) IC3.2(VCC) R33.2 R34.2 RA1.5 RA1.6 RA1.7 RA1.8 RA2.5 RA2.6 RA2.7 RA2.8 ; port VCC  [also labelled VCC]  [project net MP_VOUT+]
GND: A1.1 A2.1 A3.1 Battery1.2(-) C23.2 C24.1 IC2.4(GND) IC2.7(WP) IC3.5(N.C.) IC3.6(N.C.) IC3.7(N.C.) IC3.8(N.C.) IC3.9(N.C.) IC3.10(N.C.) IC3.11(N.C.) IC3.12(N.C.) IC3.13(GND) Power1.2(K)
32kHz: IC3.1(32kHz) RA2.2 ; port 32KHz
SCL: IC2.6(SCL) IC3.16(SCL) RA2.3 ; port SCL  [project net RAS_SCL]
SDA: IC2.5(SDA) IC3.15(SDA) RA2.4 ; port SDA  [project net RAS_SDA]
SQW: IC3.3(~{INT}/SQW) RA2.1 ; port SQW  [project net RAS_GPIO24]
NetA1_2: A1.2 IC2.1(A0) RA1.1
NetA2_2: A2.2 IC2.2(A1) RA1.2
NetA3_2: A3.2 IC2.3(A2) RA1.3
NetBattery1_1: Battery1.1(+) IC3.14(VBAT) VD2.2(K)
NetPower1_1: Power1.1(A) R34.1
NetR33_1: R33.1 VD2.1(A)

Not connected (* = marked no-connect by the designer): IC3 4(~{RST}); RA1 4*

### Library data of the parts
Battery1 = Battery Button Cell: Mini Battery
C23 C24 = C: as C9 on sheet ESP32; 学习资源: www.ooocke.com
IC2 = 24Cxx: Two-wire Serial EEPROM; BOM名称: 外置EEPROM; 版权归属: 源创客; 学习资源: www.ooocke.com
IC3 = DS3231: Real time clock chip
JP18 = Header 4: 4P connector; BOM名称: 4P接插件; 版权归属: 源创客; 学习资源: www.ooocke.com
JP19 = Header 6: 6P接插件; 版权归属: 源创客; BOM名称: 6P接插件; 学习资源: www.ooocke.com
Power1 = LED-SMD: Patch LED; BOM名称: 贴片LED; 版权归属: 源创客; 学习资源: www.ooocke.com
R33 R34 = R: Chip resistor; 版权归属: 源创客; BOM名称: Chip resistor; 学习资源: www.ooocke.com
RA1 RA2 = R-ARR: 4 way Chip Resistor Array
VD2 = 1N4148: High speed switching diode; BOM名称: 高速开关二极管; 版权归属: 源创客; 学习资源: www.ooocke.com

## Nets that join several sheets
+5: Main (JP7.2 JP7.4), LM2596 (8 pins)
+12: Main (JP3#1.1), LM2596 (5 pins), U_MPregulator (7 pins), U_MPregulator (7 pins)
GND: Main (9 pins), ESP32 (8 pins), LM2596 (11 pins), LORA (E3.2 U4.1 U4.8 U4.10), U_MPregulator (14 pins), QUECTEL (20 pins), MAX485 (6 pins), RF (E4.2 U6.9 U6.11), ZIGBEE (LED3.2 U5.A1), DS3231 (18 pins), U_MPregulator (14 pins)
MP_VOUT+: ESP32 (6 pins), LORA (U4.13), U_MPregulator (8 pins), QUECTEL (D2.1), MAX485 (11 pins), RF (U6.8), ZIGBEE (U5.A2), DS3231 (14 pins), U_MPregulator (8 pins)
32kHz: Main (JP7.16), DS3231 (IC3.1 RA2.2)
485_A: Main (5 pins), MAX485 (R21.2 R22.1 U7.6)
485_B: Main (5 pins), MAX485 (R20.2 R21.1 U7.7)
485_DE: Main (RS2.3), MAX485 (6 pins)
485_DI: Main (RS3.3), MAX485 (R19.1 R23.2 R25.1 U7.4)
485_RO: Main (RS1.3), MAX485 (R16.1 U7.1)
ESP_DE: Main (RS2.2), ESP32 (U3.30)
ESP_DI: Main (RS3.2), ESP32 (U3.37)
ESP_LORA_SS: Main (RS15.2), ESP32 (U3.11)
ESP_RFM_SS: Main (RS14.2), ESP32 (U3.10)
ESP_RO: Main (RS1.2), ESP32 (U3.36)
ESP_RXD0: Main (RS4.2), ESP32 (JP16.5 U3.34)
ESP_RXD2: Main (RS5.2), ESP32 (U3.27)
ESP_TXD0: Main (RS6.2), ESP32 (JP16.6 U3.35)
ESP_TXD2: Main (RS7.2), ESP32 (U3.28)
LORA_SS: Main (RS15.3), LORA (U4.5)
QUECTEL_RXD: Main (RS7.3), QUECTEL (QM1.18)
QUECTEL_TXD: Main (RS5.3), QUECTEL (QM1.17)
RAS_ESP_SS: Main (JP7.37), ESP32 (U3.12)
RAS_GPIO24: Main (JP7.18), DS3231 (IC3.3 RA2.1)
RAS_MISO: Main (JP7.35), ESP32 (U3.14), LORA (U4.2), RF (U6.13)
RAS_MOSI: Main (JP7.38), ESP32 (U3.16), LORA (U4.3), RF (U6.14)
RAS_SCK: Main (JP7.40), ESP32 (U3.13), LORA (U4.4), RF (U6.12)
RAS_SCL: Main (JP7.5), DS3231 (IC2.6 IC3.16 RA2.3)
RAS_SDA: Main (JP7.3), DS3231 (IC2.5 IC3.15 RA2.4)
RFM_SS: Main (RS14.3), RF (U6.15)
ZIGBEE_RXD: Main (RS6.3), ZIGBEE (U5.B6)
ZIGBEE_TXD: Main (RS4.3), ZIGBEE (U5.B5)